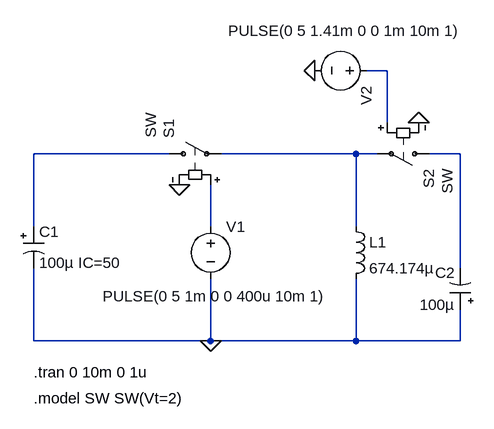
[diagram p0: schematic Coilgun-1V02.asc]
Coilgun-1V02.asc, the LTspice schematic file:
Version 4
SHEET 1 880 680
WIRE 432 -128 400 -128
WIRE 432 -48 432 -128
WIRE 96 0 -112 0
WIRE 384 0 176 0
WIRE 416 0 384 0
WIRE 544 0 496 0
WIRE -112 112 -112 0
WIRE 160 112 160 48
WIRE 384 112 384 0
WIRE 544 176 544 0
WIRE -112 288 -112 176
WIRE 160 288 160 192
WIRE 160 288 -112 288
WIRE 384 288 384 192
WIRE 384 288 160 288
WIRE 544 288 544 240
WIRE 544 288 384 288
FLAG 160 288 0
FLAG 112 48 0
FLAG 480 -48 0
FLAG 320 -128 0
SYMBOL polcap -128 112 R0
WINDOW 3 24 56 Left 2
SYMATTR InstName C1
SYMATTR Value 100µ IC=50
SYMATTR SpiceLine V=63 Irms=900m Rser=0 Lser=0
SYMATTR Description Capacitor
SYMATTR Type cap
SYMBOL ind 368 96 R0
SYMATTR InstName L1
SYMATTR Value 674.174µ
SYMATTR SpiceLine Rser=0
SYMBOL sw 80 0 R270
WINDOW 3 24 -12 Left 2
WINDOW 38 24 -12 Left 2
SYMATTR InstName S1
SYMATTR Value ""
SYMATTR SpiceModel SW
SYMBOL voltage 160 96 R0
WINDOW 3 -166 123 Left 2
WINDOW 123 0 0 Left 2
WINDOW 39 0 0 Left 2
SYMATTR InstName V1
SYMATTR Value PULSE(0 5 1m 0 0 400u 10m 1)
SYMBOL polcap 560 240 R180
WINDOW 0 24 57 Left 2
WINDOW 3 24 8 Left 2
SYMATTR InstName C2
SYMATTR Value 100µ
SYMATTR Description Capacitor
SYMATTR Type cap
SYMATTR SpiceLine V=100 Irms=385m Rser=0 Lser=0
SYMBOL sw 512 0 R90
WINDOW 3 24 -12 Left 2
WINDOW 38 24 -12 Left 2
SYMATTR InstName S2
SYMATTR Value ""
SYMATTR SpiceModel SW
SYMBOL voltage 416 -128 R90
WINDOW 3 -61 -129 VRight 2
WINDOW 123 0 0 Left 2
WINDOW 39 0 0 Left 2
SYMATTR InstName V2
SYMATTR Value PULSE(0 5 1.41m 0 0 1m 10m 1)
TEXT -112 336 Left 2 !.tran 0 10m 0 1u
TEXT -112 376 Left 2 !.model SW SW(Vt=2)

The netlist it stands for:
* Coilgun-1V02.asc
C1 N002 0 100µ IC=50 V=63 Irms=900m Rser=0 Lser=0
L1 N003 0 674.174µ Rser=0
S1 N002 N003 N005 0 SW
V1 N005 0 PULSE(0 5 1m 0 0 400u 10m 1)
C2 0 N004 100µ V=100 Irms=385m Rser=0 Lser=0
S2 N004 N003 N001 0 SW
V2 N001 0 PULSE(0 5 1.41m 0 0 1m 10m 1)
.tran 0 10m 0 1u
.model SW SW(Vt=2)
.backanno
.end